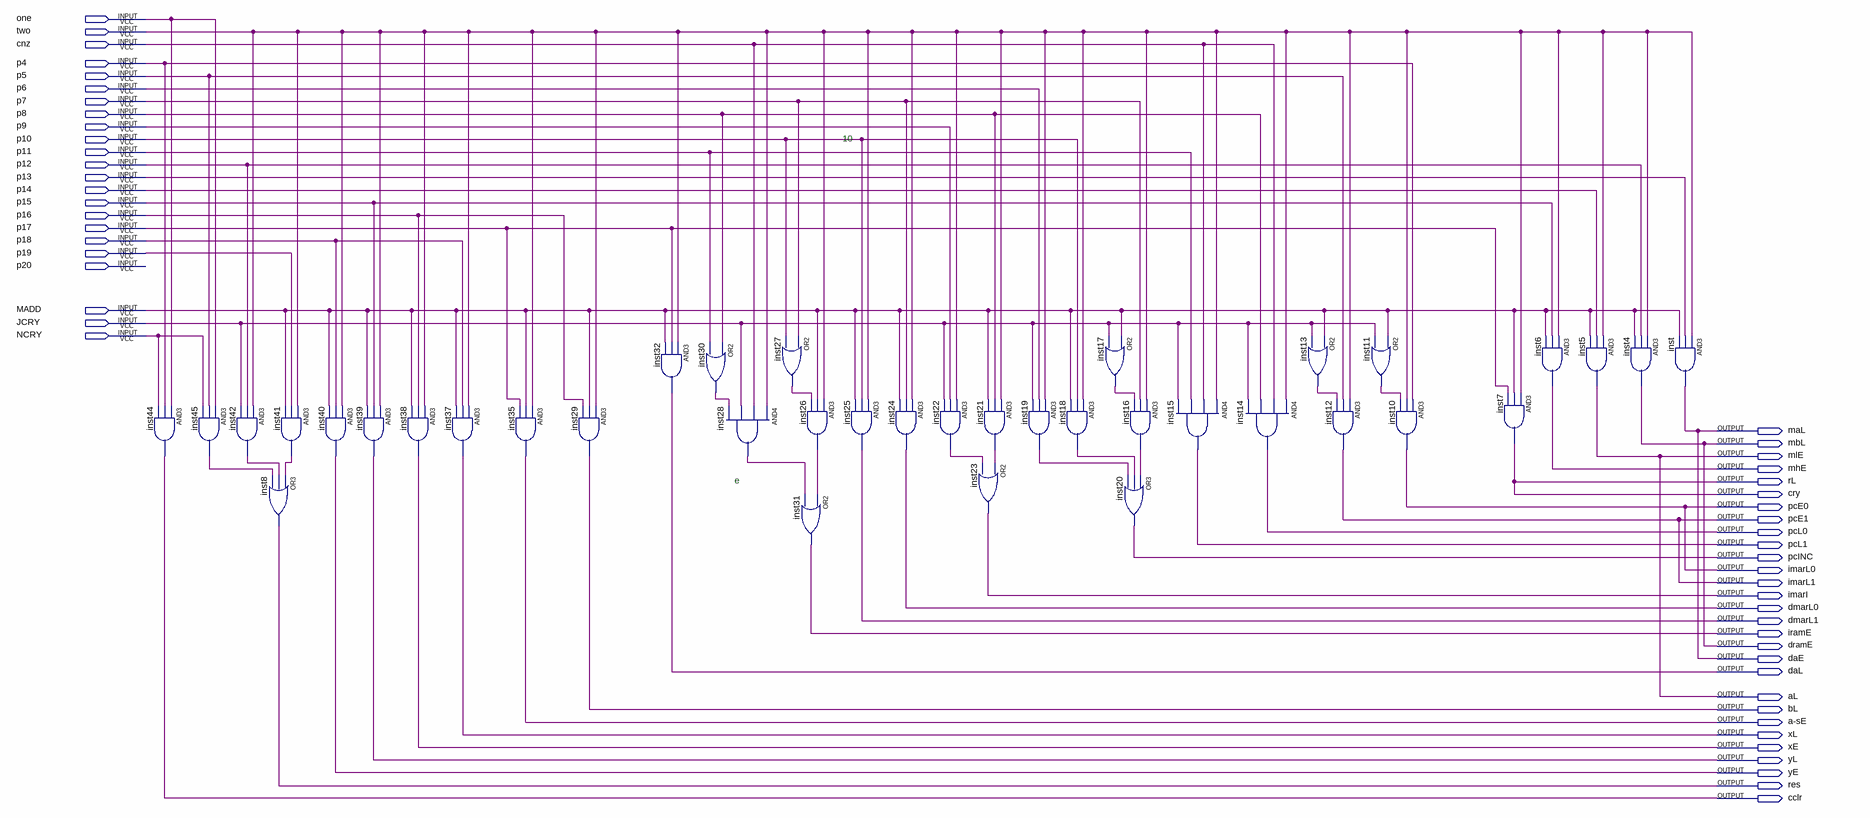
[diagram p0: schematic sheet]
// Quartus schematic kzjz_c.bdf as structural Verilog: 38 symbols, 52 pins
module kzjz_c (
  input  one,
  input  two,
  input  cnz,
  input  p4,
  input  p5,
  input  p6,
  input  p7,
  input  p8,
  input  p9,
  input  p10,
  input  p11,
  input  p12,
  input  p13,
  input  p14,
  input  p15,
  input  p16,
  input  p17,
  input  p18,
  input  p19,
  input  p20,
  input  MADD,
  input  JCRY,
  input  NCRY,
  output maL,
  output mbL,
  output mlE,
  output mhE,
  output rL,
  output cry,
  output pcE0,
  output pcE1,
  output pcL0,
  output pcL1,
  output pcINC,
  output imarL0,
  output imarL1,
  output imarI,
  output dmarL0,
  output dmarL1,
  output iramE,
  output dramE,
  output daE,
  output daL,
  output aL,
  output bL,
  output \a-sE ,
  output xL,
  output xE,
  output yL,
  output yE,
  output res,
  output cclr
);

  wire inst11_out, inst13_out, inst16_out, inst17_out, inst18_out, inst19_out, inst21_out, inst22_out,
       inst26_out, inst27_out, inst28_out, inst30_out, inst41_out, inst42_out, inst45_out;

  and inst44 (cclr, one, p4, NCRY);
  and inst45 (inst45_out, one, p5, NCRY);
  and inst42 (inst42_out, two, p12, JCRY);
  or inst8 (res, inst41_out, inst42_out, inst45_out);
  and inst40 (yE, two, p18, MADD);
  and inst41 (inst41_out, two, p19, MADD);
  and inst39 (yL, two, p15, MADD);
  and inst38 (xE, two, p16, MADD);
  and inst37 (xL, two, p18, MADD);
  and inst35 (\a-sE , two, MADD, p17);
  and inst29 (bL, two, MADD, p16);
  and inst32 (daL, two, p17, MADD);
  or inst30 (inst30_out, p8, p11);
  and inst28 (inst28_out, two, cnz, JCRY, inst30_out);
  or inst27 (inst27_out, p7, p10);
  and inst26 (inst26_out, two, MADD, inst27_out);
  or inst31 (iramE, inst26_out, inst28_out);
  and inst25 (dmarL1, two, p10, MADD);
  and inst24 (dmarL0, two, p7, MADD);
  and inst21 (inst21_out, two, p8, MADD);
  and inst22 (inst22_out, two, p9, JCRY);
  or inst23 (imarI, inst21_out, inst22_out);
  and inst19 (inst19_out, two, p6, JCRY);
  and inst18 (inst18_out, two, p10, MADD);
  or inst17 (inst17_out, MADD, JCRY);
  and inst16 (inst16_out, two, p7, inst17_out);
  or inst20 (pcINC, inst16_out, inst18_out, inst19_out);
  and inst15 (pcL1, two, cnz, p11, JCRY);
  and inst14 (pcL0, two, cnz, p8, JCRY);
  or inst13 (inst13_out, MADD, JCRY);
  and inst12 (imarL1, two, p5, inst13_out);
  or inst11 (inst11_out, MADD, JCRY);
  and inst10 (imarL0, p4, two, inst11_out);
  and inst6 (mhE, two, p15, MADD);
  and inst7 (cry, two, MADD, p17);
  and inst5 (aL, two, p14, MADD);
  and inst4 (dramE, two, p12, MADD);
  and inst (daE, two, p13, MADD);

  assign maL = daE;
  assign mbL = dramE;
  assign mlE = aL;
  assign pcE0 = imarL0;
  assign pcE1 = imarL1;
  assign rL = cry;

  // Notes on the sheet:
  //   10
  //   e
endmodule
